# EAGLE board 2x_PJE_Sensoren_DS (EAGLE 9.2.2), part 1 of 2
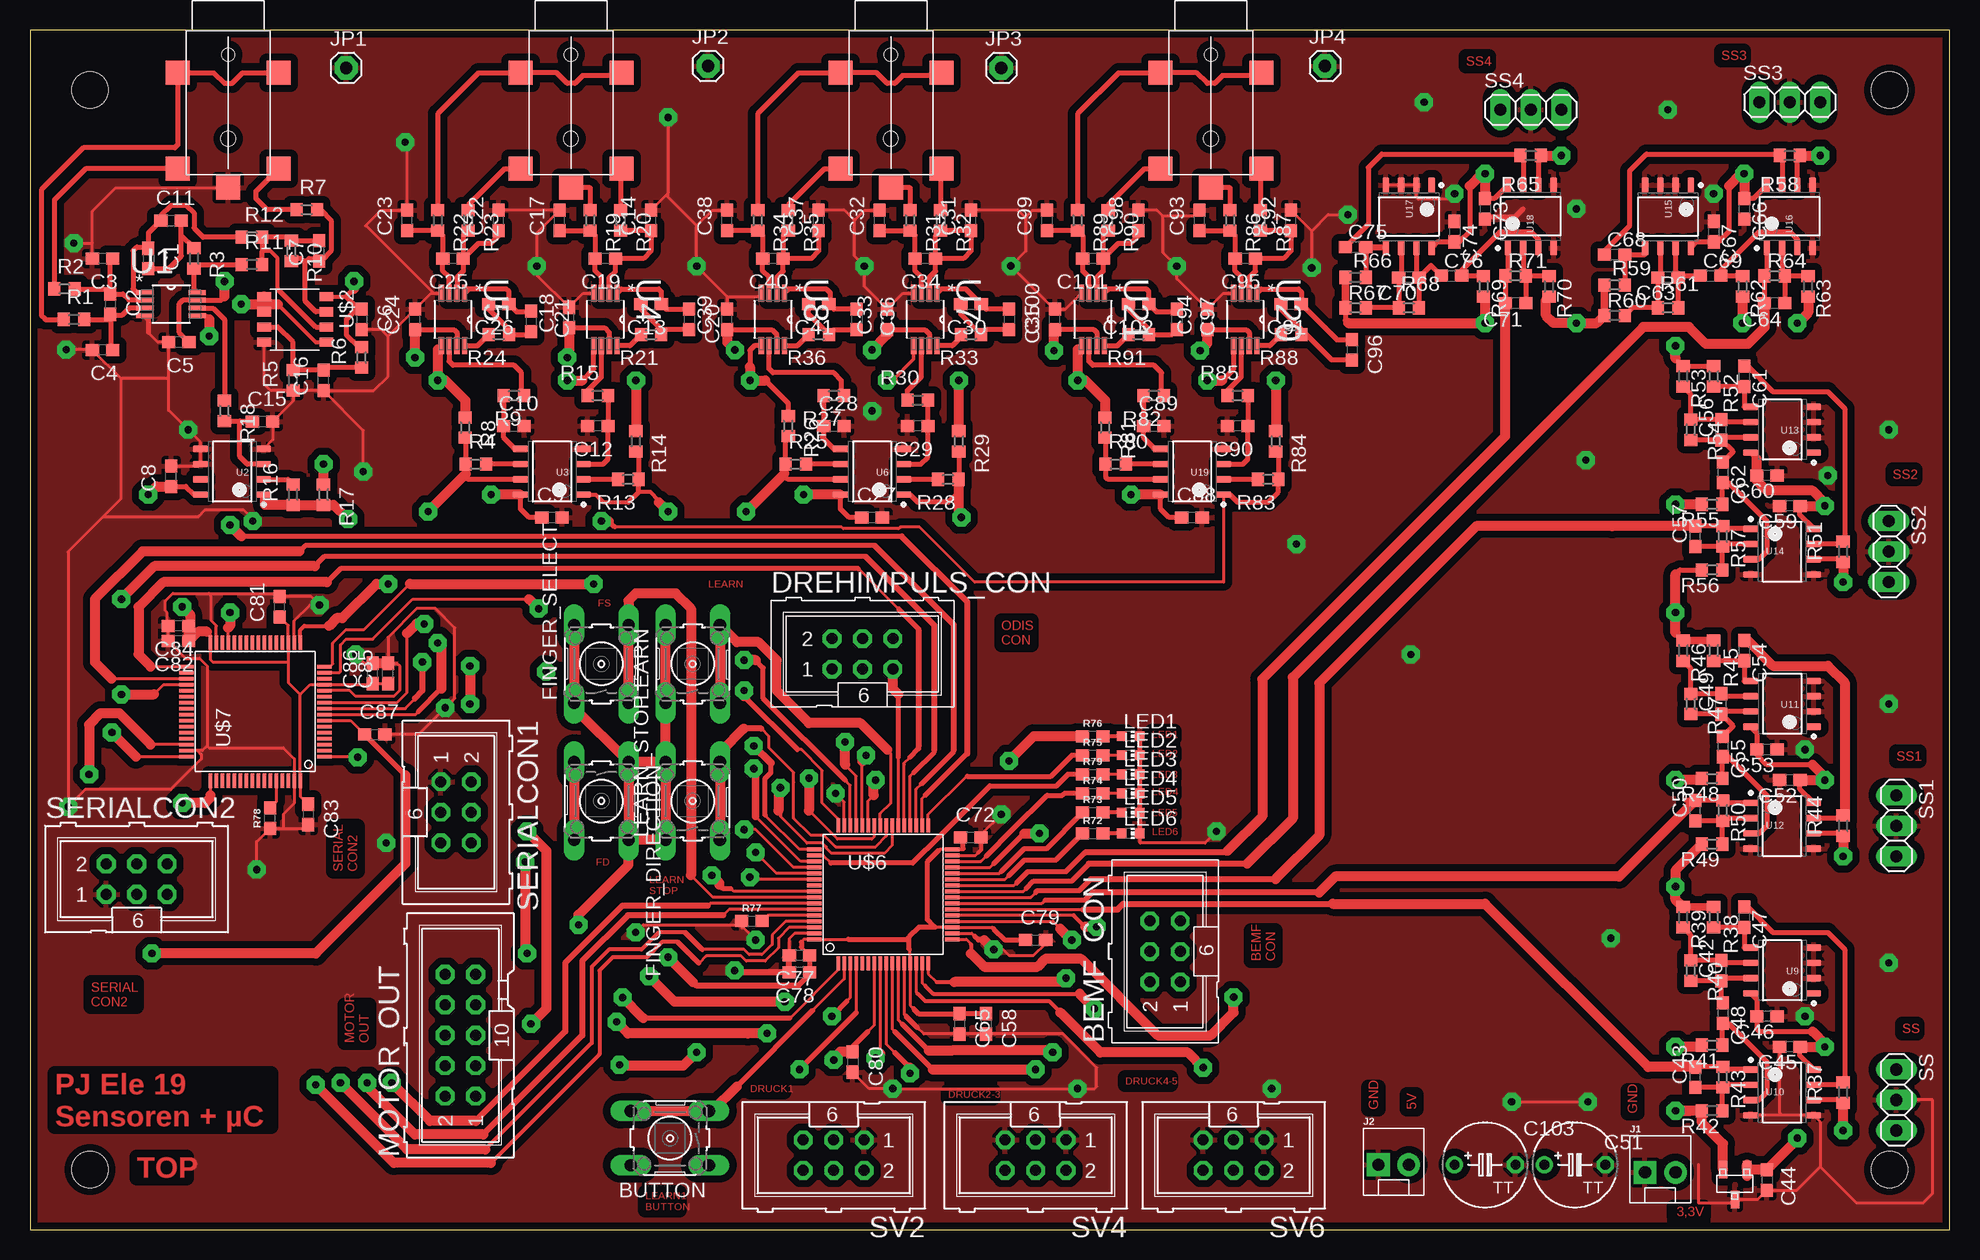
[diagram p19: board, top side]
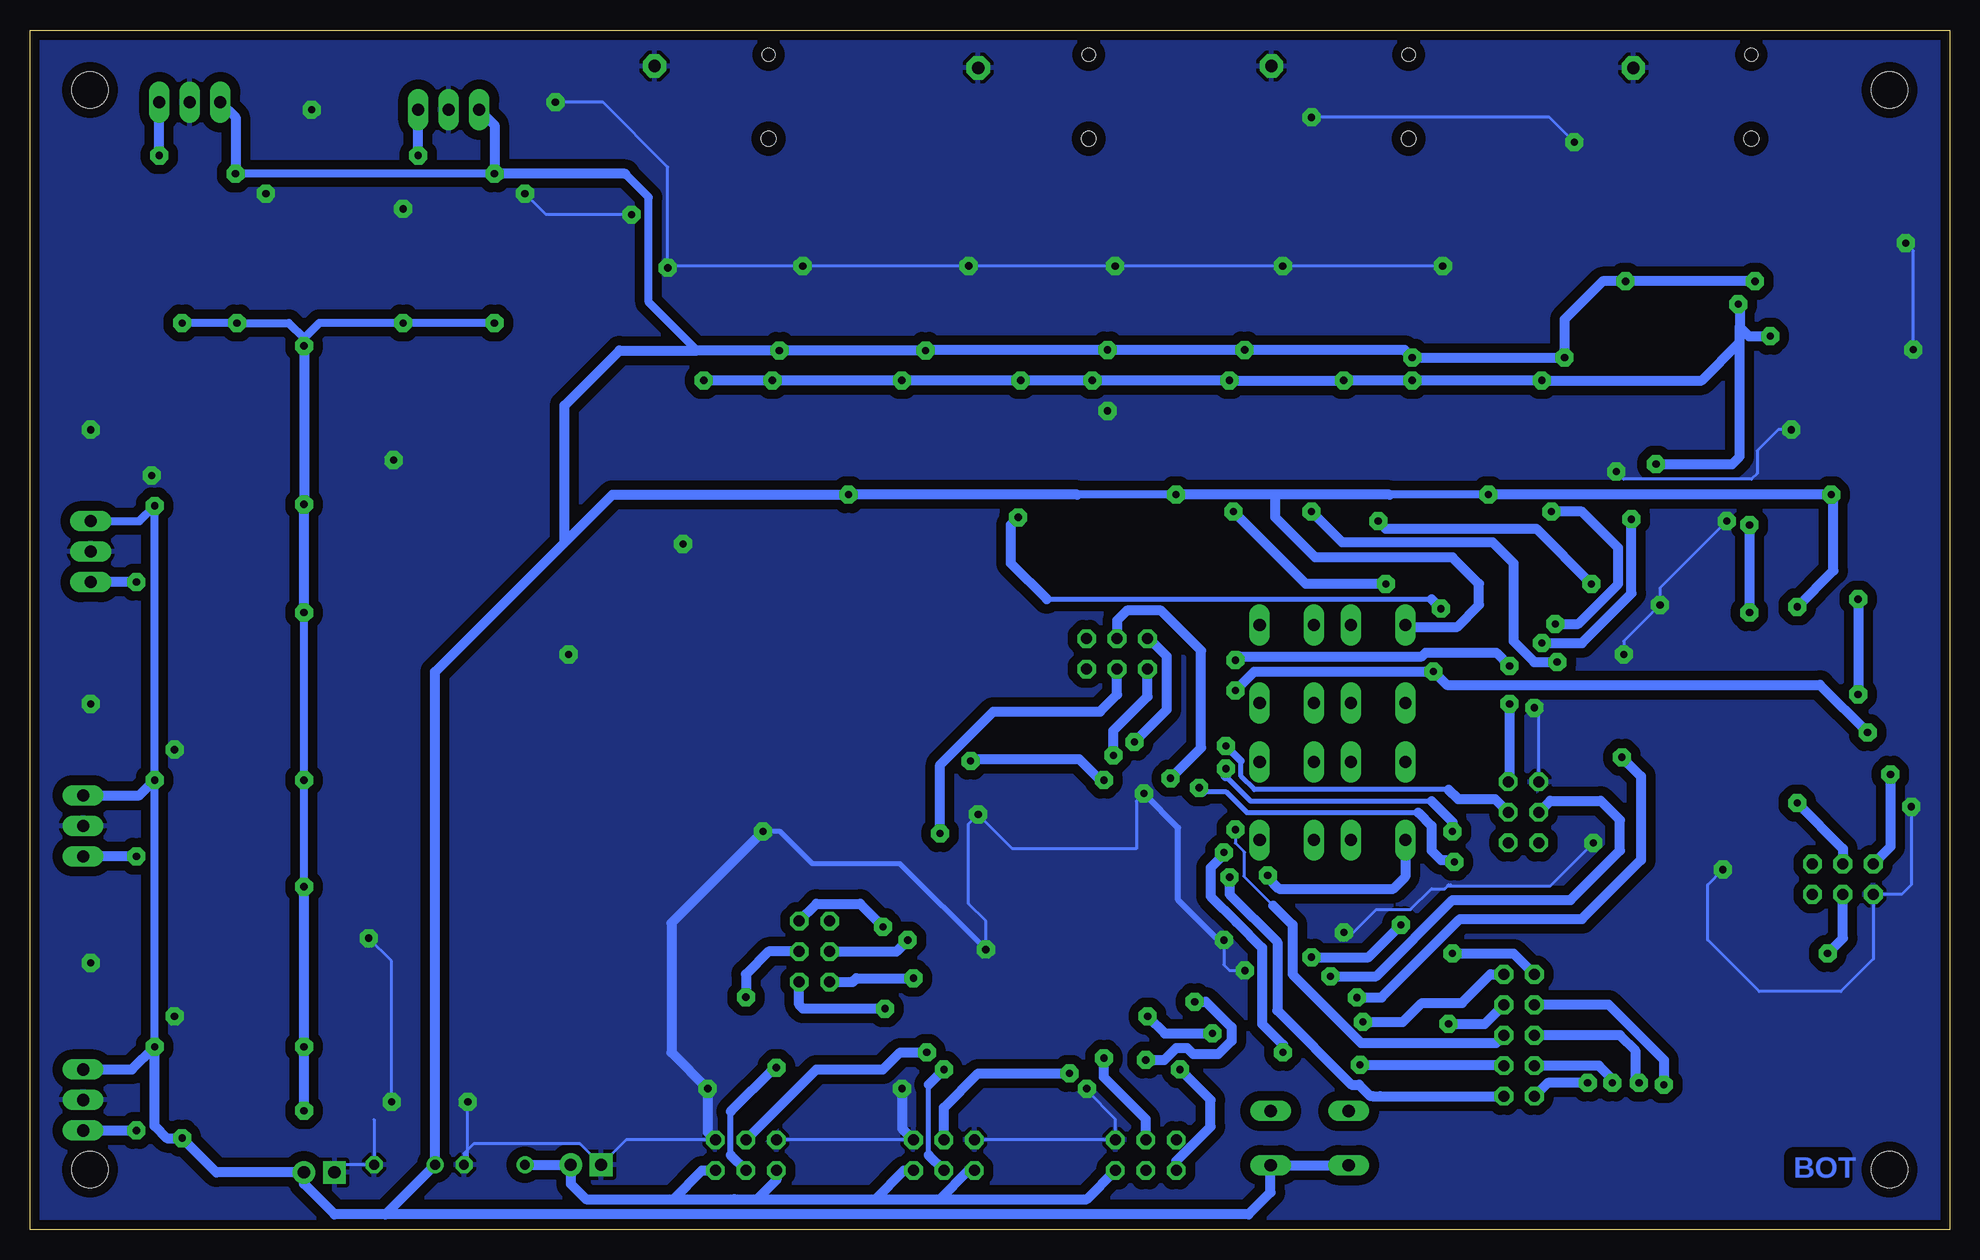
[diagram p20: board, bottom side, seen from below]

Size 160 x 100 mm. Coordinates in mm from the lower left corner, seen from the top.
Outline: 0,0 160,0 160,100 0,100 0,0
Copper layers (1*16): Top 0.035mm / dielectric 1.5mm / Bottom 0.035mm
Design rules "EMSP_SMD_DRC_2019 *": minimum track width 6.5mil, minimum drill 0.6mm, track to track 11mil, track to pad 0.25mm, pad to pad 0.25mm, via to via 11mil, smd to smd 8mil, copper to edge 20mil, drill to drill 16mil, minimum pad ring 12mil, minimum via ring 12mil, stop-mask expansion 4mil, vias tented up to drill 0mil, thermal gap 12mil
Holes 3 mm at 5,5 5,95 155,95 155,5

## Footprints (pad centres in the part's own frame; a part is rotated, then mirrored left to right if it is on the bottom)
ML6 = drill 0.914 octagon: 1 -2.54,-1.27; 2 -2.54,1.27; 3 0,-1.27; 4 0,1.27; 5 2.54,-1.27; 6 2.54,1.27
B3F-10XX = drill 1.016 long: 1 -3.251,2.261; 2 3.251,2.261; 3 -3.251,-2.261; 4 3.251,-2.261
C0603 = smd 1.1 x 1: 1 -0.85,0; 2 0.85,0
TAP5-70 = drill 0.813: + -2.54,0 | drill 0.813 octagon: - 2.54,0
MOLEX-1X2 = drill 1.016 pad 1.88 square: 1 0,0 | drill 1.016 pad 1.88: 2 2.54,0
1X01 = drill 1.016 pad 1.93 octagon: 1 0,0
CHIP-LED0603 = smd 0.8 x 0.8: A 0,-0.75; C 0,0.75
ML10 = drill 0.914 octagon: 1 -5.08,-1.27; 2 -5.08,1.27; 3 -2.54,-1.27; 4 -2.54,1.27; 5 0,-1.27; 6 0,1.27; 7 2.54,-1.27; 8 2.54,1.27; 9 5.08,-1.27; 10 5.08,1.27
R0603 = smd 1 x 1.1: 1 -0.85,0; 2 0.85,0
0603 = smd 1.1 x 1: 1 -0.85,0; 2 0.85,0
1X03 = drill 1.016 long: 1 -2.54,0; 2 0,0; 3 2.54,0
SOP65P490X110-8N = smd 1.422 x 0.432: 1 -2.184,0.965; 2 -2.184,0.33; 3 -2.184,-0.33; 4 -2.184,-0.965; 5 2.184,-0.965; 6 2.184,-0.33; 7 2.184,0.33; 8 2.184,0.965
TEXAS_INSTRUMENTS_OPA2314AID_0 = smd 1.25 x 0.55: 1 -2.625,1.905; 2 -2.625,0.635; 3 -2.625,-0.635; 4 -2.625,-1.905; 5 2.625,-1.905; 6 2.625,-0.635; 7 2.625,0.635; 8 2.625,1.905
USR_SJ2-4514A = smd 2 x 2: 1 -1.1,3.5; 2 8.5,-0.7; 2_2 8.5,7.7; 3 0.5,7.7; 4 0.5,-0.7 | hole 1.1: 10,3.5 | hole 1.2: 3,3.5
S8 = smd 0.762 x 1.143: P$1 -1.905,-2.413; P$2 -0.635,-2.413; P$3 0.635,-2.413; P$4 1.905,-2.413; P$5 1.905,2.794; P$6 0.635,2.794; P$7 -0.635,2.794; P$8 -1.905,2.794
MAX6018X_SOT-3 = smd 0.711 x 1.422: GND 0,1.5; IN -1,-1; OUT 1,-1
LQFP64 = smd 0.3 x 1.2: 1 -3.75,-5.75; 2 -3.25,-5.75; 3 -2.75,-5.75; 4 -2.25,-5.75; 5 -1.75,-5.75; 6 -1.25,-5.75; 7 -0.75,-5.75; 8 -0.25,-5.75; 9 0.25,-5.75; 10 0.75,-5.75; 11 1.25,-5.75; 12 1.75,-5.75; 13 2.25,-5.75; 14 2.75,-5.75; 15 3.25,-5.75; 16 3.75,-5.75; 33 3.75,5.75; 34 3.25,5.75; 35 2.75,5.75; 36 2.25,5.75; 37 1.75,5.75; 38 1.25,5.75; 39 0.75,5.75; 40 0.25,5.75; 41 -0.25,5.75; 42 -0.75,5.75; 43 -1.25,5.75; 44 -1.75,5.75; 45 -2.25,5.75; 46 -2.75,5.75; 47 -3.25,5.75; 48 -3.75,5.75 | smd 1.2 x 0.3: 17 5.75,-3.75; 18 5.75,-3.25; 19 5.75,-2.75; 20 5.75,-2.25; 21 5.75,-1.75; 22 5.75,-1.25; 23 5.75,-0.75; 24 5.75,-0.25; 25 5.75,0.25; 26 5.75,0.75; 27 5.75,1.25; 28 5.75,1.75; 29 5.75,2.25; 30 5.75,2.75; 31 5.75,3.25; 32 5.75,3.75; 49 -5.75,3.75; 50 -5.75,3.25; 51 -5.75,2.75; 52 -5.75,2.25; 53 -5.75,1.75; 54 -5.75,1.25; 55 -5.75,0.75; 56 -5.75,0.25; 57 -5.75,-0.25; 58 -5.75,-0.75; 59 -5.75,-1.25; 60 -5.75,-1.75; 61 -5.75,-2.25; 62 -5.75,-2.75; 63 -5.75,-3.25; 64 -5.75,-3.75

## Placement (x,y rotation side)
BEMF_CON  [ML6]  94.61,23.18 90 top
BUTTON  [B3F-10XX]  53.34,7.62 180 top
C1  22u  [C0603]  9.86,80.95 270 top
C2  1n  [C0603]  6.68,77.14 270 top
C3  10n  [C0603]  6.05,80.95 180 top
C4  10n  [C0603]  6.05,73.33 180 top
C5  100n  [C0603]  12.4,73.97 180 top
C6  100n  [C0603]  27.64,75.87 270 top
C7  1n  [C0603]  24.08,81.58 90 top
C8  100n  [C0603]  11.77,62.79 90 top
C9  100n  [C0603]  43.52,59.36 0 top
C10  10n  [C0603]  40.34,66.98 0 top
C11  10u  [C0603]  11.77,84.12 0 top
C12  10n  [C0603]  47.33,66.98 180 top
C13  22u  [C0603]  51.77,77.14 180 top
C14  10n  [C0603]  51.77,84.12 90 top
C15  10n  [C0603]  19.39,67.36 0 top
C16  1u  [C0603]  24.46,70.79 90 top
C17  10n  [C0603]  44.15,84.12 90 top
C18  100n  [C0603]  44.94,76.03 90 top
C19  1n  [C0603]  47.96,80.95 180 top
C20  10u  [C0603]  54.95,75.87 270 top
C21  22u  [C0603]  41.77,75.71 270 top
C22  10n  [C0603]  39.07,84.12 90 top
C23  10n  [C0603]  31.45,84.12 90 top
C24  100n  [C0603]  32.09,75.87 90 top
C25  1n  [C0603]  35.26,80.95 180 top
C26  10u  [C0603]  39.07,77.14 180 top
C27  100n  [C0603]  70.19,59.36 0 top
C28  10n  [C0603]  67.01,66.98 0 top
C29  10n  [C0603]  74,66.98 180 top
C30  22u  [C0603]  78.44,77.14 180 top
C31  10n  [C0603]  78.44,84.12 90 top
C32  10n  [C0603]  70.82,84.12 90 top
C33  100n  [C0603]  71.45,75.87 90 top
C34  1n  [C0603]  74.63,80.95 180 top
C35  10u  [C0603]  81.61,75.87 270 top
C36  22u  [C0603]  68.92,75.87 270 top
C37  10n  [C0603]  65.74,84.12 90 top
C38  10n  [C0603]  58.12,84.12 90 top
C39  100n  [C0603]  58.12,75.87 90 top
C40  1n  [C0603]  61.93,80.95 180 top
C41  10u  [C0603]  65.74,77.14 180 top
C42  470n  [C0603]  140.97,21.59 90 top
C43  47µ  [C0603]  138.81,12.7 90 top
C44  1µ  [C0603]  144.78,4.13 270 top
C45  100n  [C0603]  146.69,15.24 180 top
C46  100n  [C0603]  144.78,17.78 180 top
C47  0,47u  [C0603]  142.88,26.04 270 top
C48  0,47u  [C0603]  141.1,18.03 270 top
C49  470n  [C0603]  140.97,43.81 90 top
C50  47µ  [C0603]  138.81,34.92 90 top
C51  47u  [TAP5-70]  128.78,5.4 0 top
C52  100n  [C0603]  146.69,37.47 180 top
C53  100n  [C0603]  144.78,40.01 180 top
C54  0,47u  [C0603]  142.88,48.26 270 top
C55  0,47u  [C0603]  141.1,40.26 270 top
C56  470n  [C0603]  140.97,66.67 90 top
C57  47µ  [C0603]  138.81,57.78 90 top
C58  1 uF  [C0603]  79.69,17.14 270 top
C59  100n  [C0603]  146.69,60.33 180 top
C60  100n  [C0603]  144.78,62.87 180 top
C61  0,47u  [C0603]  142.88,71.12 270 top
C62  0,47u  [C0603]  141.1,63.12 270 top
C63  470n  [C0603]  136.53,79.38 180 top
C64  47µ  [C0603]  145.41,77.22 180 top
C65  10n  [C0603]  77.47,17.14 270 top
C66  100n  [C0603]  142.88,85.09 270 top
C67  100n  [C0603]  140.34,83.19 270 top
C68  0,47u  [C0603]  132.08,81.28 0 top
C69  0,47u  [C0603]  140.08,79.5 0 top
C70  470n  [C0603]  114.94,79.38 180 top
C71  47µ  [C0603]  123.83,77.22 180 top
C72  100n  [C0603]  78.42,32.7 0 top
C73  100n  [C0603]  121.28,85.09 270 top
C74  100n  [C0603]  118.75,83.19 270 top
C75  0,47u  [C0603]  110.49,81.92 0 top
C76  0,47u  [C0603]  118.49,79.5 0 top
C77  100n  [C0603]  64.14,22.86 180 top
C78  4,7 uF  [C0603]  64.14,21.43 180 top
C79  100n  [C0603]  83.82,24.13 0 top
C80  100n  [C0603]  68.58,13.97 270 top
C81  100n  [C0603]  20.83,51.91 90 top
C82  100n  [C0603]  12.38,49.05 180 top
C83  100n  [C0603]  23.18,34.61 270 top
C84  4,7u  [C0603]  12.38,50.32 180 top
C85  1 uF  [C0603]  29.84,46.35 90 top
C86  10n  [C0603]  28.57,46.35 90 top
C87  100n  [C0603]  28.73,41.27 0 top
C88  100n  [C0603]  96.86,59.36 0 top
C89  10n  [C0603]  93.68,66.98 0 top
C90  10n  [C0603]  100.67,66.98 180 top
C91  22u  [C0603]  105.11,77.14 180 top
C92  10n  [C0603]  105.11,84.12 90 top
C93  10n  [C0603]  97.49,84.12 90 top
C94  100n  [C0603]  98.12,75.87 90 top
C95  1n  [C0603]  101.3,80.95 180 top
C96  10u  [C0603]  110.19,73.33 270 top
C97  22u  [C0603]  95.58,75.87 270 top
C98  10n  [C0603]  92.41,84.12 90 top
C99  10n  [C0603]  84.79,84.12 90 top
C100  100n  [C0603]  85.42,75.87 90 top
C101  1n  [C0603]  88.6,80.95 180 top
C102  10u  [C0603]  92.41,77.14 180 top
C103  47u  [TAP5-70]  121.28,5.4 0 top
DREHIMPULS_CON  [ML6]  69.39,47.99 0 top
FINGER_DIRECTION  finger_direction  [B3F-10XX]  47.62,35.72 270 top
FINGER_SELECT  finger_select  [B3F-10XX]  47.62,47.15 90 top
J1  [MOLEX-1X2]  134.62,4.76 0 top
J2  [MOLEX-1X2]  112.39,5.4 0 top
JP1  [1X01]  26.35,96.84 0 top
JP2  [1X01]  56.52,97 0 top
JP3  [1X01]  80.96,96.84 0 top
JP4  [1X01]  107.95,97 0 top
LEARN  [B3F-10XX]  55.24,47.15 90 top
LEARN_STOP  [B3F-10XX]  55.24,35.72 90 top
LED1  [CHIP-LED0603]  91.76,41.12 270 top
LED2  [CHIP-LED0603]  91.76,39.53 270 top
LED3  [CHIP-LED0603]  91.76,37.94 270 top
LED4  [CHIP-LED0603]  91.76,36.35 270 top
LED5  [CHIP-LED0603]  91.76,34.77 270 top
LED6  [CHIP-LED0603]  91.76,33.02 270 top
MOTOR_OUT  Motor Out  [ML10]  35.88,16.19 90 top
R1  22k  [R0603]  3.67,75.87 0 top
R2  22K  [R0603]  2.88,78.41 0 top
R3  500  [R0603]  13.67,80.95 270 top
R4  220k  [R0603]  37.16,63.8 0 top
R5  22k  [R0603]  21.93,70.79 90 top
R6  22k  [R0603]  27.64,72.69 90 top
R7  22k  [R0603]  23.07,85.01 0 top
R8  22k  [R0603]  36.28,66.85 270 top
R9  22k  [R0603]  40.34,69.52 180 top
R10  39k  [R0603]  21.8,81.58 270 top
R11  10k  [R0603]  18.5,80.44 0 top
R12  10k  [R0603]  18.5,82.73 0 top
R13  220k  [R0603]  49.87,62.53 180 top
R14  22k  [R0603]  50.5,65.71 270 top
R15  22k  [R0603]  47.33,69.52 0 top
R16  220k  [R0603]  21.93,61.27 90 top
R17  22k  [R0603]  24.46,61.27 270 top
R18  22k  [R0603]  16.21,68.25 270 top
R19  22k  [R0603]  46.69,84.12 270 top
R20  22K  [R0603]  49.23,84.12 270 top
R21  500  [R0603]  51.77,74.6 180 top
R22  22k  [R0603]  33.99,84.12 270 top
R23  22K  [R0603]  36.53,84.12 270 top
R24  500  [R0603]  39.07,74.6 180 top
R25  220k  [R0603]  63.84,63.8 0 top
R26  22k  [R0603]  63.2,66.98 270 top
R27  22k  [R0603]  67.01,69.52 180 top
R28  220k  [R0603]  76.53,62.53 180 top
R29  22k  [R0603]  77.42,65.71 270 top
R30  22k  [R0603]  74,69.14 0 top
R31  22k  [R0603]  73.36,84.12 270 top
R32  22K  [R0603]  75.9,84.12 270 top
R33  500  [R0603]  78.44,74.6 180 top
R34  22k  [R0603]  60.66,84.12 270 top
R35  22K  [R0603]  63.2,84.12 270 top
R36  500  [R0603]  65.74,74.6 180 top
R37  1M  [R0603]  151.13,11.43 90 top
R38  680k  [R0603]  140.34,26.04 270 top
R39  120  [R0603]  137.79,26.04 270 top
R40  168k  [R0603]  138.43,21.59 270 top
R41  680k  [R0603]  140.21,15.37 180 top
R42  1k  [R0603]  140.21,9.91 180 top
R43  560  [R0603]  141.1,12.7 270 top
R44  1M  [R0603]  151.13,33.66 90 top
R45  680k  [R0603]  140.34,48.26 270 top
R46  120  [R0603]  137.79,48.26 270 top
R47  168k  [R0603]  138.43,43.81 270 top
R48  680k  [R0603]  140.21,37.59 180 top
R49  1k  [R0603]  140.21,32.13 180 top
R50  560  [R0603]  141.1,34.92 270 top
R51  1M  [R0603]  151.13,56.52 90 top
R52  680k  [R0603]  140.34,71.12 270 top
R53  120  [R0603]  137.79,71.12 270 top
R54  168k  [R0603]  138.43,66.67 270 top
R55  680k  [R0603]  140.21,60.45 180 top
R56  1k  [R0603]  140.21,54.99 180 top
R57  560  [R0603]  141.1,57.78 270 top
R58  1M  [R0603]  146.69,89.53 180 top
R59  680k  [R0603]  132.08,78.74 0 top
R60  120  [R0603]  132.08,76.2 0 top
R61  168k  [R0603]  136.53,76.83 0 top
R62  680k  [R0603]  142.75,78.61 270 top
R63  1k  [R0603]  148.21,78.61 270 top
R64  560  [R0603]  145.41,79.5 0 top
R65  1M  [R0603]  125.09,89.53 180 top
R66  680k  [R0603]  110.49,79.38 0 top
R67  120  [R0603]  110.49,76.83 0 top
R68  168k  [R0603]  114.94,76.83 0 top
R69  680k  [R0603]  121.16,78.61 270 top
R70  1k  [R0603]  126.62,78.61 270 top
R71  560  [R0603]  123.83,79.5 0 top
R72  470  [0603]  88.58,33.02 0 top
R73  470  [0603]  88.58,34.77 0 top
R74  470  [0603]  88.58,36.35 0 top
R75  470  [0603]  88.58,39.53 0 top
R76  470  [0603]  88.58,41.12 0 top
R77  9.76k  [0603]  60.17,25.72 0 top
R78  9.76k  [0603]  20,34.29 90 top
R79  470  [0603]  88.58,37.94 0 top
R80  220k  [R0603]  90.5,63.8 0 top
R81  22k  [R0603]  89.62,66.85 270 top
R82  22k  [R0603]  93.68,69.52 180 top
R83  220k  [R0603]  103.2,62.53 180 top
R84  22k  [R0603]  103.84,65.71 270 top
R85  22k  [R0603]  100.67,69.52 0 top
R86  22k  [R0603]  100.03,84.12 270 top
R87  22K  [R0603]  102.57,84.12 270 top
R88  500  [R0603]  105.11,74.6 180 top
R89  22k  [R0603]  87.33,84.12 270 top
R90  22K  [R0603]  89.87,84.12 270 top
R91  500  [R0603]  92.41,74.6 180 top
SERIALCON1  Serial Connection  [ML6]  35.51,34.78 270 top
SERIALCON2  Serial Connection  [ML6]  8.89,29.21 0 top
SS  [1X03]  155.57,10.79 270 top
SS1  [1X03]  155.57,33.66 270 top
SS2  [1X03]  154.94,56.52 270 top
SS3  [1X03]  146.69,93.98 0 top
SS4  [1X03]  125.09,93.34 0 top
SV2  Druck Sensor  [ML6]  66.99,6.19 180 top
SV4  Druck Sensor  [ML6]  83.82,6.19 180 top
SV6  Druck Sensor  [ML6]  100.33,6.19 180 top
U1  INA333AIDGKR  [SOP65P490X110-8N]  11.77,77.14 0 top
U2  TEXAS_INSTRUMENTS_OPA2314AIDTEXAS_INSTRUMENTS_OPA2314AID_0_0  [TEXAS_INSTRUMENTS_OPA2314AID_0]  16.84,63.17 180 top
U3  TEXAS_INSTRUMENTS_OPA2314AIDTEXAS_INSTRUMENTS_OPA2314AID_0_0  [TEXAS_INSTRUMENTS_OPA2314AID_0]  43.52,63.17 180 top
U4  INA333AIDGKR  [SOP65P490X110-8N]  47.96,75.87 270 top
U5  INA333AIDGKR  [SOP65P490X110-8N]  35.26,75.87 270 top
U6  TEXAS_INSTRUMENTS_OPA2314AIDTEXAS_INSTRUMENTS_OPA2314AID_0_0  [TEXAS_INSTRUMENTS_OPA2314AID_0]  70.19,63.17 180 top
U7  INA333AIDGKR  [SOP65P490X110-8N]  74.63,75.87 270 top
U8  INA333AIDGKR  [SOP65P490X110-8N]  61.93,75.87 270 top
U9  TEXAS_INSTRUMENTS_OPA2314AIDTEXAS_INSTRUMENTS_OPA2314AID_0_0  [TEXAS_INSTRUMENTS_OPA2314AID_0]  146.05,21.59 180 top
U10  TEXAS_INSTRUMENTS_OPA2314AIDTEXAS_INSTRUMENTS_OPA2314AID_0_0  [TEXAS_INSTRUMENTS_OPA2314AID_0]  146.05,11.43 0 top
U11  TEXAS_INSTRUMENTS_OPA2314AIDTEXAS_INSTRUMENTS_OPA2314AID_0_0  [TEXAS_INSTRUMENTS_OPA2314AID_0]  146.05,43.81 180 top
U12  TEXAS_INSTRUMENTS_OPA2314AIDTEXAS_INSTRUMENTS_OPA2314AID_0_0  [TEXAS_INSTRUMENTS_OPA2314AID_0]  146.05,33.66 0 top
U13  TEXAS_INSTRUMENTS_OPA2314AIDTEXAS_INSTRUMENTS_OPA2314AID_0_0  [TEXAS_INSTRUMENTS_OPA2314AID_0]  146.05,66.67 180 top
U14  TEXAS_INSTRUMENTS_OPA2314AIDTEXAS_INSTRUMENTS_OPA2314AID_0_0  [TEXAS_INSTRUMENTS_OPA2314AID_0]  146.05,56.52 0 top
U15  TEXAS_INSTRUMENTS_OPA2314AIDTEXAS_INSTRUMENTS_OPA2314AID_0_0  [TEXAS_INSTRUMENTS_OPA2314AID_0]  136.53,84.45 270 top
U16  TEXAS_INSTRUMENTS_OPA2314AIDTEXAS_INSTRUMENTS_OPA2314AID_0_0  [TEXAS_INSTRUMENTS_OPA2314AID_0]  146.69,84.45 90 top
U17  TEXAS_INSTRUMENTS_OPA2314AIDTEXAS_INSTRUMENTS_OPA2314AID_0_0  [TEXAS_INSTRUMENTS_OPA2314AID_0]  114.94,84.45 270 top
U18  TEXAS_INSTRUMENTS_OPA2314AIDTEXAS_INSTRUMENTS_OPA2314AID_0_0  [TEXAS_INSTRUMENTS_OPA2314AID_0]  125.09,84.45 90 top
U19  TEXAS_INSTRUMENTS_OPA2314AIDTEXAS_INSTRUMENTS_OPA2314AID_0_0  [TEXAS_INSTRUMENTS_OPA2314AID_0]  96.86,63.17 180 top
U20  INA333AIDGKR  [SOP65P490X110-8N]  101.3,75.87 270 top
U21  INA333AIDGKR  [SOP65P490X110-8N]  88.6,75.87 270 top
U$1  SJ2-3514A  [USR_SJ2-4514A]  20.02,87.94 90 top
U$2  LT1678  [S8]  21.93,75.87 270 top
U$3  SJ2-3514A  [USR_SJ2-4514A]  48.59,87.94 90 top
U$4  SJ2-3514A  [USR_SJ2-4514A]  75.27,87.94 90 top
U$5  MAX6018X_MAX6018X  [MAX6018X_SOT-3]  142.11,4 180 top
U$6  STM32L476RCT  [LQFP64]  71.12,27.94 0 top
U$7  STM32L476RCT  [LQFP64]  18.78,43.18 90 top
U$8  SJ2-3514A  [USR_SJ2-4514A]  101.94,87.94 90 top